# Altium schematic sheet 接口单元.schdoc
size 447 x 194 mm
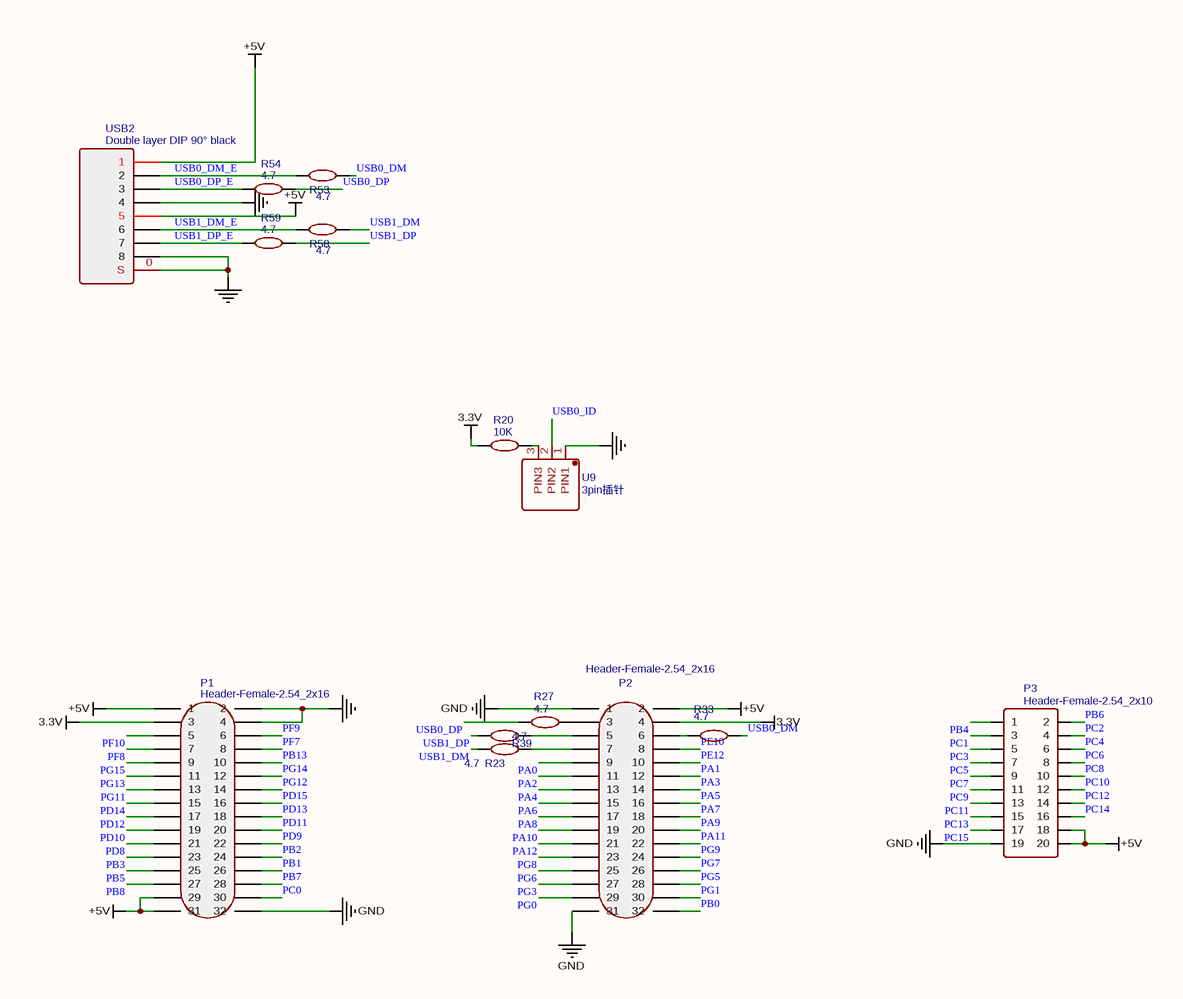
[diagram p0: 接口单元.schdoc]

## Parts
P1  Header-Female-2.54_2x16  [HDR-16X2/2.54]
P2  Header-Female-2.54_2x16  [HDR-16X2/2.54]
P3  Header-Female-2.54_2x10  [HDR-10X2/2.54]
R20  10K  [0603]
R23  4.7  [0603]
R27  4.7  [0603]
R33  4.7  [0603]
R39  4.7  [0603]
R53  4.7  [0603]
R54  4.7  [0603]
R58  4.7  [0603]
R59  4.7  [0603]
U9  3pin插针  [HDR-3X1/2.54]
USB2  Double layer DIP 90° black  [USB-M-51]

## Nets
3.3V: P1.3 P2.4 R20.2
+5V: P1.1 P1.29 P1.31 P2.2 P3.18 P3.20 USB2.1 USB2.5
GND: P1.2 P1.4 P1.32 P2.1 P2.31 P3.19 U9.1(PIN1) USB2.0(S) USB2.4 USB2.8
PA0: P2.9
PA1: P2.12
PA2: P2.11
PA3: P2.14
PA4: P2.13
PA5: P2.16
PA6: P2.15
PA7: P2.18
PA8: P2.17
PA9: P2.20
PA10: P2.19
PA11: P2.22
PA12: P2.21
PB0: P2.32
PB1: P1.26
PB2: P1.24
PB3: P1.23
PB4: P3.1
PB5: P1.25
PB6: P3.2
PB7: P1.28
PB8: P1.27
PB13: P1.10
PC0: P1.30
PC1: P3.3
PC2: P3.4
PC3: P3.5
PC4: P3.6
PC5: P3.7
PC6: P3.8
PC7: P3.9
PC8: P3.10
PC9: P3.11
PC10: P3.12
PC11: P3.13
PC12: P3.14
PC13: P3.15
PC14: P3.16
PC15: P3.17
PD8: P1.21
PD9: P1.22
PD10: P1.19
PD11: P1.20
PD12: P1.17
PD13: P1.18
PD14: P1.15
PD15: P1.16
PE10: P2.8
PE12: P2.10
PF7: P1.8
PF8: P1.7
PF9: P1.6
PF10: P1.5
PG0: P2.29
PG1: P2.30
PG3: P2.27
PG5: P2.28
PG6: P2.25
PG7: P2.26
PG8: P2.23
PG9: P2.24
PG11: P1.13
PG12: P1.14
PG13: P1.11
PG14: P1.12
PG15: P1.9
USB0_DM: R33.2 R53.2
USB0_DM_E: R53.1 USB2.2
USB0_DP: R27.2 R54.2
USB0_DP_E: R54.1 USB2.3
USB0_ID: U9.2(PIN2)
USB1_DM: R39.1 R58.2
USB1_DM_E: R58.1 USB2.6
USB1_DP: R23.1 R59.2
USB1_DP_E: R59.1 USB2.7
NetP2_3: P2.3 R27.1
NetP2_5: P2.5 R23.2
NetP2_6: P2.6 R33.1
NetP2_7: P2.7 R39.2
NetR20_1: R20.1 U9.3(PIN3)

## Library data of the parts
P1 P2 = Header-Female-2.54_2x16: BOM_Manufacturer: EasyEDA; BOM_EasyEDA: E55795; BOM_Supplier Part: E55795; BOM_Supplier: EasyEDA; BOM_Manufacturer Part: Header-Female-2.54_2x16; spicePre: P
P3 = Header-Female-2.54_2x10: BOM_Manufacturer: BOOMELE; BOM_Manufacturer Part: 2.54mm,2×10Double row female; BOM_Supplier: LCSC; image: //image.lceda.cn/szlcsc/C30867.jpg; BOM_Supplier Part: C30867; spicePre: P
R20 = 10K: BOM_Manufacturer: UniOhm; BOM_Manufacturer Part: 0603WAF1002T5E; nameAlias: Resistance (Ohms); BOM_Supplier: LCSC; BOM_LCSC Assembly: Yes; BOM_Supplier Part: C25804; spicePre: R; spiceSymbolName: 0603WAF1002T5E
R23 R27 R33 R39 R53 R54 R58 R59 = 4.7: BOM_Manufacturer: UniOhm; BOM_Manufacturer Part: 0603WAF470KT5E; nameAlias: Resistance (Ohms); BOM_Supplier: LCSC; BOM_Supplier Part: C23164; BOM_LCSC Assembly: Yes; spicePre: R; spiceSymbolName: 0402WGF470KTCE
U9 = 3pin插针: Contributor: DesignMyself; BOM_Manufacturer Part: 3pin插针; spicePre: U
USB2 = Double layer DIP 90° black: BOM_Manufacturer: ValuePro; BOM_Supplier: LCSC; BOM_Manufacturer Part: Double layer DIP 90° black; image: //image.lceda.cn/szlcsc/C12049.jpg; BOM_Supplier Part: C12049; spicePre: U